# EAGLE design ATtiny84 ICSP-v7 (EAGLE 7.7.0)
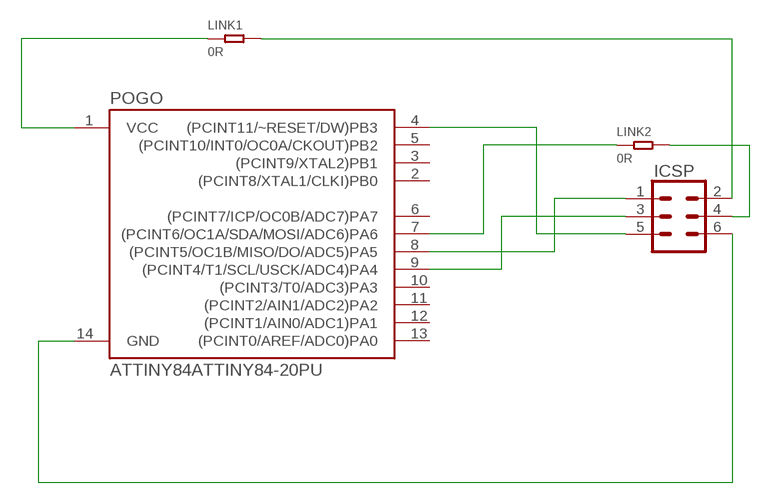
[diagram p0: schematic, sheet 1]

## Parts
ICSP  CONN_03X2SHROUD  [2X3-SHROUDED]
LINK1  0R  DIP-RES-100R-5%-1/4W(PR-D2.3XL6.5MM)  [PR-D2.3XL6.5MM]
LINK2  0R  DIP-RES-100R-5%-1/4W(PR-D2.3XL6.5MM)  [PR-D2.3XL6.5MM]
POGO  ATTINY84ATTINY84-20PU  [DIP14]

## Nets
GND: ICSP.6 POGO.14(GND)
N$1: ICSP.1 POGO.8((PCINT5/OC1B/MISO/DO/ADC5)PA5)
N$2: ICSP.3 POGO.9((PCINT4/T1/SCL/USCK/ADC4)PA4)
N$3: ICSP.5 POGO.4((PCINT11/~RESET/DW)PB3)
N$4: ICSP.2 LINK1.2
N$6: LINK2.1 POGO.7((PCINT6/OC1A/SDA/MOSI/ADC6)PA6)
N$7: LINK1.1 POGO.1(VCC)
N$8: ICSP.4 LINK2.2
Unconnected: POGO.2((PCINT8/XTAL1/CLKI)PB0) POGO.3((PCINT9/XTAL2)PB1) POGO.5((PCINT10/INT0/OC0A/CKOUT)PB2) POGO.6((PCINT7/ICP/OC0B/ADC7)PA7) POGO.10((PCINT3/T0/ADC3)PA3) POGO.11((PCINT2/AIN1/ADC2)PA2) POGO.12((PCINT1/AIN0/ADC1)PA1) POGO.13((PCINT0/AREF/ADC0)PA0)

## Library data of the parts
ICSP = SparkFun-Connectors:CONN_03X2: Multi connection point. Often used as Generic Header-pin footprint for 0.1 inch spaced/style header connections You can populate with any combo of single row headers, but if you'd like an exact match, check these: Header - 2x3 (Male, 0.1") <https://www.sparkfun.com/products/12807> (PRT-12807) Header - 2x3 (Female, 0.1") <https://www.sparkfun.com/products/13010> (PRT-13010) 2x3 Pin Shrouded Header <https://www.sparkfun.com/products/10877> (PRT-10877) On any of the 0.1 inch spaced packages, you can populate with these: Break Away Headers - Straight <https://www.sparkfun.com/products/116> (PRT-00116) Break Away Male Headers - Right Angle <https://www.sparkfun.com/products/553> (PRT-00553) Female Headers <https://www.sparkfun.com/products/115> (PRT-00115) Break Away Headers - Machine Pin <https://www.sparkfun.com/products/117> (PRT-00117) Break Away Female Headers - Swiss Machine Pin <https://www.sparkfun.com/products/743> (PRT-00743) Special note: the shrouded connector mates well with our 3x2 ribbon cables: Ribbon Crimp Connector - 6-pin (2x3, Female) <https://www.sparkfun.com/products/10651> (PRT-10651) Ribbon Cable - 6 wire (15ft) <https://www.sparkfun.com/products/10646> (PRT-10646); PROD_ID: CONN-10681; SF_ID: PRT_10877
LINK1 LINK2 = Seeed-Resistor:DIP-RES-100R-5%-1/4W(PR-D2.3XL6.5MM): 301020017; MPN: FHCFR-1/4W-101J; SPICEPREFIX: L; VALUE: 100R
POGO = SparkFun-IC-Microcontroller:ATTINY84: Atmel 14-pin 2/4/8kB flash uC Datasheet <https://cdn.sparkfun.com/datasheets/Widgets/doc8006.pdf> SparkFun Products Tiny AVR Programmer <https://www.sparkfun.com/products/11801> (PGM-11801) SparkFun Servo Trigger - Continuous Rotation <https://www.sparkfun.com/products/13872> (WIG-13872) SparkFun Servo Trigger <https://www.sparkfun.com/products/13118> (WIG-13118)

## Board
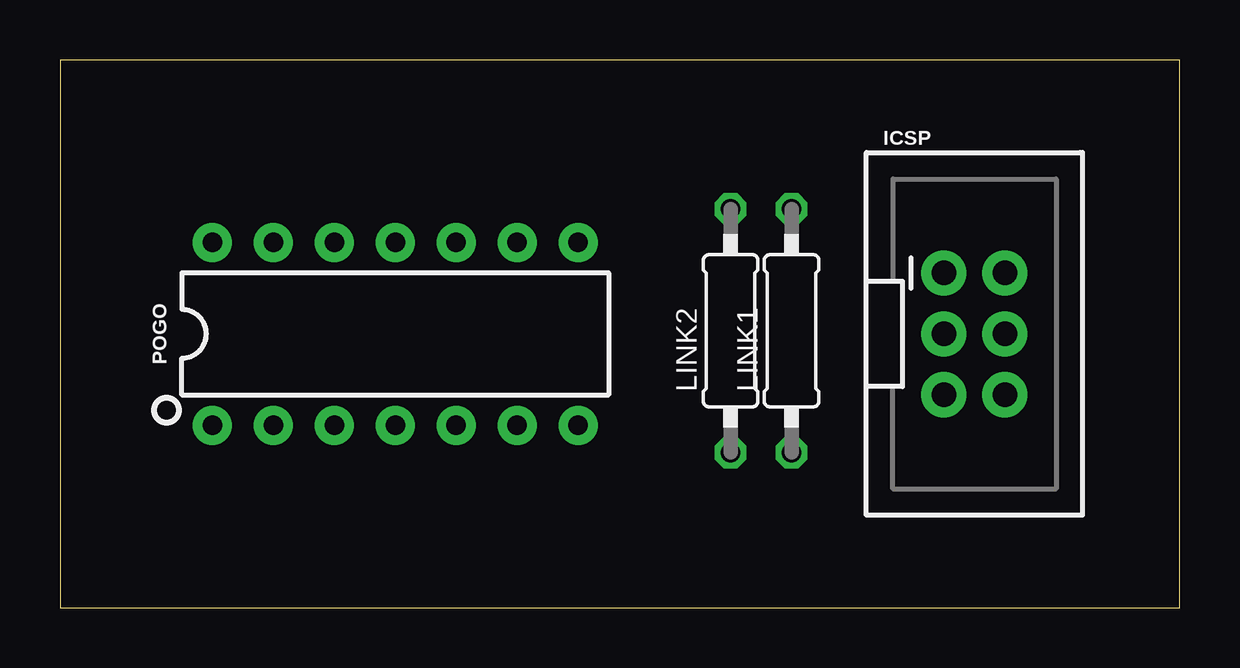
[diagram p1: board, top side]
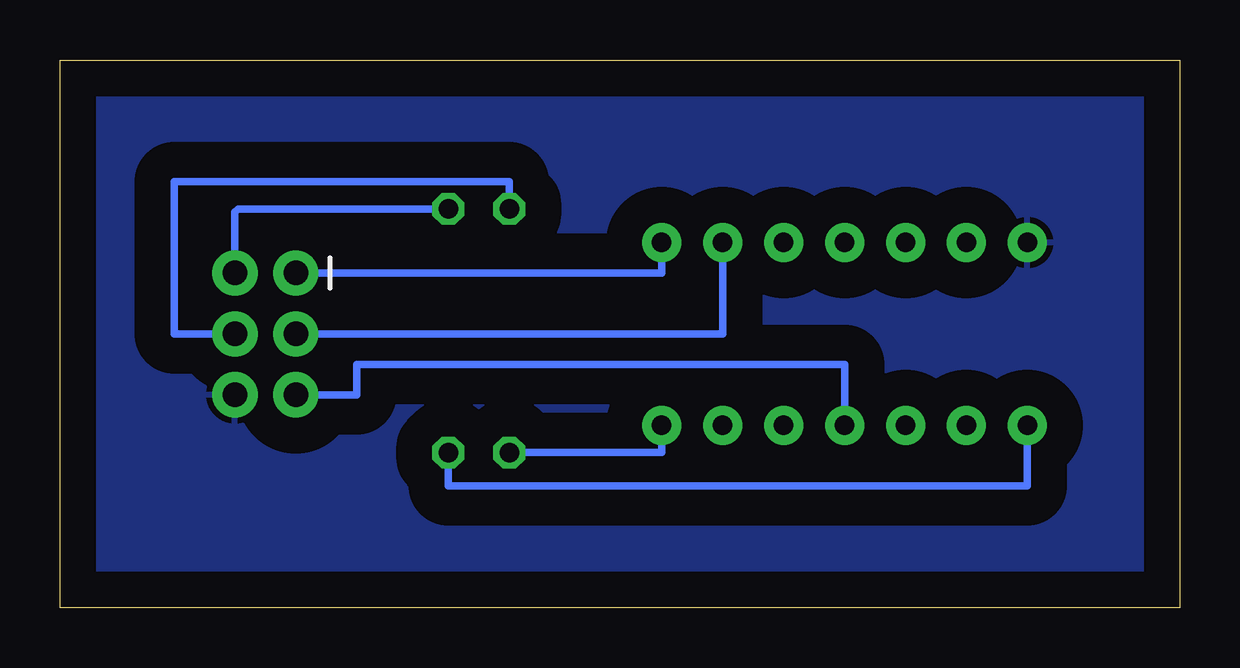
[diagram p2: board, bottom side, seen from below]

Size 46.66 x 22.85 mm. Coordinates in mm from the lower left corner, seen from the top.
Outline: 0,0 46.66,0 46.66,22.85 0,22.85 0,0
Copper layers (1*16): Top 0.035mm / dielectric 1.5mm / Bottom 0.035mm
Design rules "default": minimum track width 6mil, minimum drill 0.35mm, track to track 6mil, track to pad 6mil, pad to pad 6mil, via to via 6mil, smd to smd 6mil, copper to edge 40mil, drill to drill 6mil, minimum pad ring 10mil, minimum via ring 8mil, stop-mask expansion 4mil, vias tented up to drill 0mil, thermal gap 10mil

### Footprints (pad centres in the part's own frame; a part is rotated, then mirrored left to right if it is on the bottom)
2X3-SHROUDED = drill 1.016 pad 1.88: 1 -1.27,2.54; 2 1.27,2.54; 3 -1.27,0; 4 1.27,0; 5 -1.27,-2.54; 6 1.27,-2.54
PR-D2.3XL6.5MM = drill 0.813 octagon: 1 -4.953,0; 2 5.207,0
DIP14 = drill 0.813 pad 1.626: 1 -7.62,-3.81; 2 -5.08,-3.81; 3 -2.54,-3.81; 4 0,-3.81; 5 2.54,-3.81; 6 5.08,-3.81; 7 7.62,-3.81; 8 7.62,3.81; 9 5.08,3.81; 10 2.54,3.81; 11 0,3.81; 12 -2.54,3.81; 13 -5.08,3.81; 14 -7.62,3.81

### Placement (x,y rotation side)
ICSP  38.1,11.43 0 top
LINK1  30.48,11.43 90 top
LINK2  27.94,11.43 90 top
POGO  13.97,11.43 0 top

### Tracks (layer width: path | path; a pad name or v marks a point on that pad's centre or on a via)
GND
  pour Bottom (isolate 1.5, rank 6): 1.27,1.27 1.27,21.59 45.72,21.59 45.72,1.27
N$1
  Bottom 0.305: POGO.8 21.59,13.97 ICSP.1
N$2
  Bottom 0.305: POGO.9 19.05,11.43 ICSP.3
N$3
  Bottom 0.305: POGO.4 13.97,10.16 34.29,10.16 34.29,8.89 ICSP.5
N$4
  Bottom 0.305: LINK1.2 39.24,16.64 39.37,16.51 ICSP.2
N$6
  Bottom 0.305: LINK2.1 21.59,6.48 POGO.7
N$7
  Bottom 0.305: LINK1.1 30.48,5.08 6.35,5.08 POGO.1
N$8
  Bottom 0.305: ICSP.4 41.91,11.43 41.91,17.78 27.94,17.78 LINK2.2